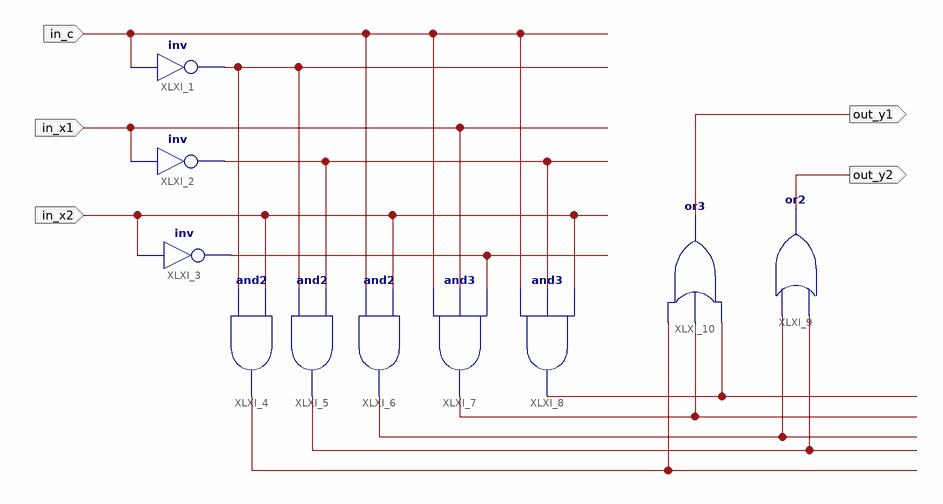
[diagram p0: schematic sheet 1]
// Xilinx ISE schematic SboxDESsch.sch (spartan3) as structural Verilog: 10 symbols, 5 ports
module SboxDESsch (
  input  in_c,
  input  in_x1,
  input  in_x2,
  output out_y1,
  output out_y2
);

  wire XLXN_6, XLXN_7, XLXN_8, XLXN_11, XLXN_12, XLXN_13, XLXN_14, XLXN_18;

  not XLXI_1 (XLXN_8, in_c);
  not XLXI_2 (XLXN_6, in_x1);
  not XLXI_3 (XLXN_7, in_x2);
  and XLXI_4 (XLXN_14, XLXN_8, in_x2);
  and XLXI_5 (XLXN_13, XLXN_8, XLXN_6);
  and XLXI_6 (XLXN_12, in_c, in_x2);
  and XLXI_7 (XLXN_11, in_c, in_x1, XLXN_7);
  and XLXI_8 (XLXN_18, in_c, XLXN_6, in_x2);
  or XLXI_9 (out_y2, XLXN_13, XLXN_12);
  or XLXI_10 (out_y1, XLXN_18, XLXN_11, XLXN_14);
endmodule
